# EAGLE design motherboard (EAGLE 9.5.2)
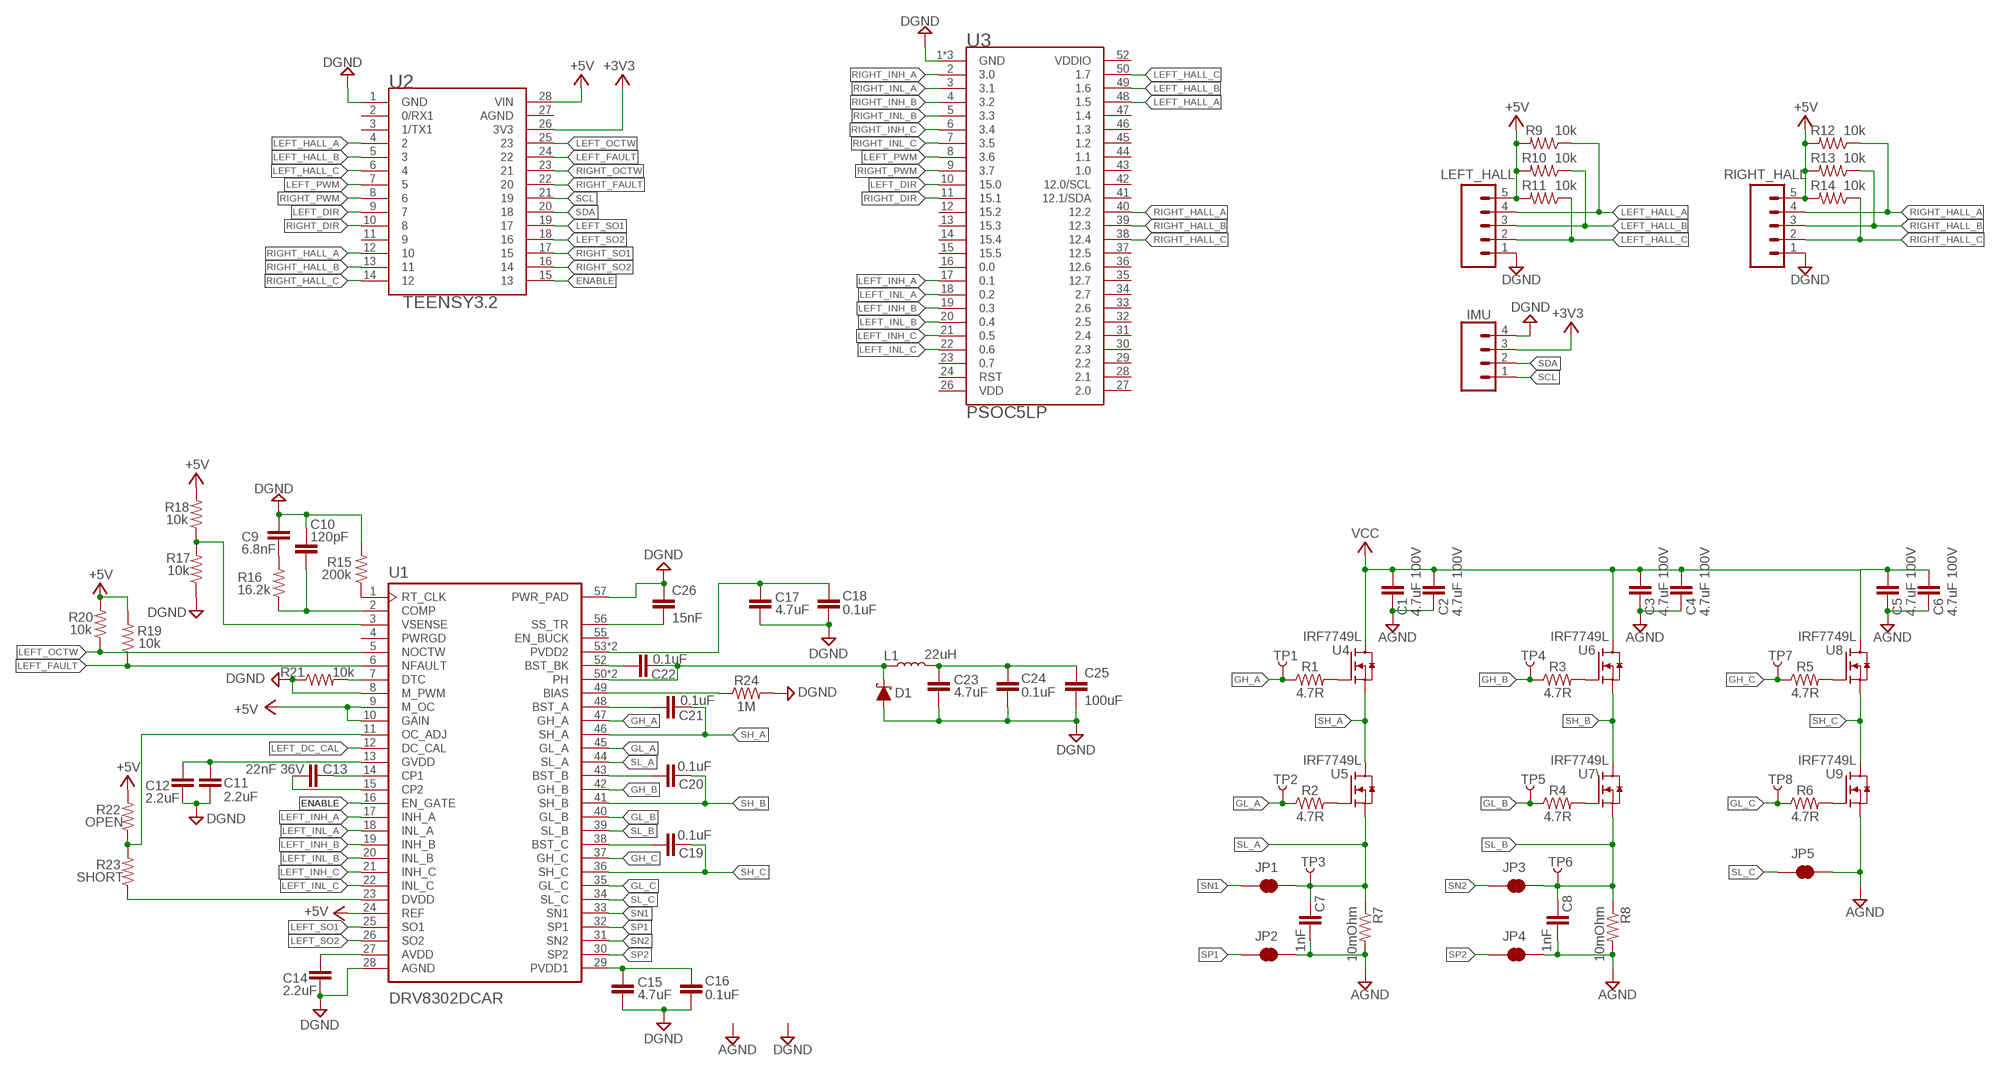
[diagram p0: schematic, sheet 1]

## Parts
C1  4.7uF 100V  10UF-1210-50V-20%  [1210]
C2  4.7uF 100V  10UF-1210-50V-20%  [1210]
C3  4.7uF 100V  10UF-1210-50V-20%  [1210]
C4  4.7uF 100V  10UF-1210-50V-20%  [1210]
C5  4.7uF 100V  10UF-1210-50V-20%  [1210]
C6  4.7uF 100V  10UF-1210-50V-20%  [1210]
C7  1nF  1.0NF/1000PF-0603-50V-10%  [0603]
C8  1nF  1.0NF/1000PF-0603-50V-10%  [0603]
C9  6.8nF  100PF-0603-50V-5%  [0603]
C10  120pF  100PF-0603-50V-5%  [0603]
C11  2.2uF  2.2UF-0805-25V-(+80/-20%)  [0805]
C12  2.2uF  2.2UF-0805-25V-(+80/-20%)  [0805]
C13  22nF 36V  22NF/22,000PF-0603-50V-10%  [0603]
C14  2.2uF  2.2UF-0805-25V-(+80/-20%)  [0805]
C15  4.7uF  4.7UF-0603-35V-(20%)  [0603]
C16  0.1uF  0.1UF-0603-25V-(+80/-20%)  [0603]
C17  4.7uF  4.7UF-0603-35V-(20%)  [0603]
C18  0.1uF  0.1UF-0603-25V-(+80/-20%)  [0603]
C19  0.1uF  0.1UF-0603-25V-(+80/-20%)  [0603]
C20  0.1uF  0.1UF-0603-25V-(+80/-20%)  [0603]
C21  0.1uF  0.1UF-0603-25V-(+80/-20%)  [0603]
C22  0.1uF  0.1UF-0603-25V-(+80/-20%)  [0603]
C23  4.7uF  4.7UF-0603-35V-(20%)  [0603]
C24  0.1uF  0.1UF-0603-25V-(+80/-20%)  [0603]
C25  100uF  100UF6.3V20%(1210)  [1210]
C26  15nF  10NF-0603-50V-10%  [0603]
D1  NRVBA2H100T3G  DIODE-SCHOTTKY-SS14  [SMA-DIODE]
IMU  SSM-104-L-SV  [SAMTEC-SSM-104-X-SV]
JP1  JUMPER-SMT_2_NC_TRACE_NO-SILK  [SMT-JUMPER_2_NC_TRACE_NO-SILK]
JP2  JUMPER-SMT_2_NC_TRACE_NO-SILK  [SMT-JUMPER_2_NC_TRACE_NO-SILK]
JP3  JUMPER-SMT_2_NC_TRACE_NO-SILK  [SMT-JUMPER_2_NC_TRACE_NO-SILK]
JP4  JUMPER-SMT_2_NC_TRACE_NO-SILK  [SMT-JUMPER_2_NC_TRACE_NO-SILK]
JP5  JUMPER-SMT_2_NC_TRACE_NO-SILK  [SMT-JUMPER_2_NC_TRACE_NO-SILK]
L1  22uH  LQH43MN330J03L  [LQH43]
LEFT_HALL  CONN_05  [1X05]
R1  4.7R  2.0KOHM-0603-1/10W-5%  [0603]
R2  4.7R  2.0KOHM-0603-1/10W-5%  [0603]
R3  4.7R  2.0KOHM-0603-1/10W-5%  [0603]
R4  4.7R  2.0KOHM-0603-1/10W-5%  [0603]
R5  4.7R  2.0KOHM-0603-1/10W-5%  [0603]
R6  4.7R  2.0KOHM-0603-1/10W-5%  [0603]
R7  10mOhm  R-US_R2512  [R2512]
R8  10mOhm  R-US_R2512  [R2512]
R9  10k  10KOHM-0603-1/10W-1%  [0603]
R10  10k  10KOHM-0603-1/10W-1%  [0603]
R11  10k  10KOHM-0603-1/10W-1%  [0603]
R12  10k  10KOHM-0603-1/10W-1%  [0603]
R13  10k  10KOHM-0603-1/10W-1%  [0603]
R14  10k  10KOHM-0603-1/10W-1%  [0603]
R15  200k  200KOHM-0603-1/10W-1%  [0603]
R16  16.2k  16.2KOHM-0603-1/10W-1%  [0603]
R17  10k  10KOHM-0603-1/10W-1%  [0603]
R18  10k  10KOHM-0603-1/10W-1%  [0603]
R19  10k  10KOHM-0603-1/10W-1%  [0603]
R20  10k  10KOHM-0603-1/10W-1%  [0603]
R21  10k  10KOHM-0603-1/10W-1%  [0603]
R22  OPEN  10KOHM-0603-1/10W-1%  [0603]
R23  SHORT  10KOHM-0603-1/10W-1%  [0603]
R24  1M  1MOHM-0603-1/4W-5%  [0603]
RIGHT_HALL  CONN_05  [1X05]
TP1  TEST-POINT3  [PAD.03X.03]
TP2  TEST-POINT3  [PAD.03X.03]
TP3  TEST-POINT3  [PAD.03X.03]
TP4  TEST-POINT3  [PAD.03X.03]
TP5  TEST-POINT3  [PAD.03X.03]
TP6  TEST-POINT3  [PAD.03X.03]
TP7  TEST-POINT3  [PAD.03X.03]
TP8  TEST-POINT3  [PAD.03X.03]
U1  DRV8302DCAR  [SOP50P810X120-57N]
U2  TEENSY3.2  [TEENSY3.2]
U3  PSOC5LP  [PSOC5LP]
U4  IRF7749L  [TRANS_AUIRF8739L2TR]
U5  IRF7749L  [TRANS_AUIRF8739L2TR]
U6  IRF7749L  [TRANS_AUIRF8739L2TR]
U7\  IRF7749L  [TRANS_AUIRF8739L2TR]
U8  IRF7749L  [TRANS_AUIRF8739L2TR]
U9  IRF7749L  [TRANS_AUIRF8739L2TR]

## Nets
+3V3: IMU.3 U2.26(3V3)
+5V: LEFT_HALL.5 R9.2 R10.2 R11.2 R12.2 R13.2 R14.2 R18.2 R19.2 R20.2 R22.2 RIGHT_HALL.5 U1.9(M_OC) U1.10(GAIN) U1.24(REF) U2.28(VIN)
AGND: C1.2 C2.2 C3.2 C4.2 C5.2 C6.2 C7.2 C8.2 JP2.2 JP4.2 JP5.2 R7.2 R8.2 U9.4(S) U9.5(S) U9.6(S) U9.7(S) U9.8(S) U9.9(S) U9.10(S) U9.11(S)
DGND: C9.1 C10.1 C11.2 C12.2 C14.2 C15.2 C16.2 C17.2 C18.2 C23.2 C24.2 C25.2 C26.1 D1.A IMU.4 LEFT_HALL.1 R15.2 R17.1 R21.1 R24.2 RIGHT_HALL.1 U1.8(M_PWM) U1.28(AGND) U1.57(PWR_PAD) U2.1(GND) U3.1(GND) U3.25(GND) U3.51(GND)
ENABLE: U1.16(EN_GATE) U2.15
GH_A: R1.1 TP1.P$1 U1.47(GH_A)
GH_B: R3.1 TP4.P$1 U1.42(GH_B)
GH_C: R5.1 TP7.P$1 U1.37(GH_C)
GL_A: R2.1 TP2.P$1 U1.45(GL_A)
GL_B: R4.1 TP5.P$1 U1.40(GL_B)
GL_C: R6.1 TP8.P$1 U1.35(GL_C)
LEFT_DC_CAL: U1.12(DC_CAL)
LEFT_DIR: U2.9 U3.10(15.0)
LEFT_FAULT: R19.1 U1.6(NFAULT) U2.24
LEFT_HALL_A: LEFT_HALL.4 R9.1 U2.4 U3.48(1.5)
LEFT_HALL_B: LEFT_HALL.3 R10.1 U2.5 U3.49(1.6)
LEFT_HALL_C: LEFT_HALL.2 R11.1 U2.6 U3.50(1.7)
LEFT_INH_A: U1.17(INH_A) U3.17(0.1)
LEFT_INH_B: U1.19(INH_B) U3.19(0.3)
LEFT_INH_C: U1.21(INH_C) U3.21(0.5)
LEFT_INL_A: U1.18(INL_A) U3.18(0.2)
LEFT_INL_B: U1.20(INL_B) U3.20(0.4)
LEFT_INL_C: U1.22(INL_C) U3.22(0.6)
LEFT_OCTW: R20.1 U1.5(NOCTW) U2.25
LEFT_PWM: U2.7 U3.8(3.6)
LEFT_SO1: U1.25(SO1) U2.19
LEFT_SO2: U1.26(SO2) U2.18
N$1: R15.1 U1.1(RT_CLK)
N$2: C9.2 R16.2
N$3: C10.2 R16.1 U1.2(COMP)
N$4: R1.2 U4.12(G)
N$5: R2.2 U5.12(G)
N$6: R3.2 U6.12(G)
N$7: R4.2 U7\.12(G)
N$8: R5.2 U8.12(G)
N$9: R6.2 U9.12(G)
N$10: R17.2 R18.1 U1.3(VSENSE)
N$11: R22.1 R23.2 U1.11(OC_ADJ)
N$12: C11.1 C12.1 U1.13(GVDD)
N$13: R21.2 U1.7(DTC)
N$14: R23.1 U1.23(DVDD)
N$15: C13.1 U1.14(CP1)
N$16: C13.2 U1.15(CP2)
N$17: C14.1 U1.27(AVDD)
N$18: C15.1 C16.1 U1.29(PVDD1)
N$19: C17.1 C18.1 U1.53(PVDD2) U1.54(PVDD2)
N$20: C19.2 U1.38(BST_C)
N$21: C20.2 U1.43(BST_B)
N$22: C21.2 U1.48(BST_A)
N$23: R24.1 U1.49(BIAS)
N$24: C22.2 U1.52(BST_BK)
N$25: C22.1 D1.C L1.1 U1.50(PH) U1.51(PH)
N$26: C23.1 C24.1 C25.1 L1.2
N$27: C26.2 U1.56(SS_TR)
RIGHT_DIR: U2.10 U3.11(15.1)
RIGHT_FAULT: U2.22
RIGHT_HALL_A: R12.1 RIGHT_HALL.4 U2.12 U3.40(12.2)
RIGHT_HALL_B: R13.1 RIGHT_HALL.3 U2.13 U3.39(12.3)
RIGHT_HALL_C: R14.1 RIGHT_HALL.2 U2.14 U3.38(12.4)
RIGHT_INH_A: U3.2(3.0)
RIGHT_INH_B: U3.4(3.2)
RIGHT_INH_C: U3.6(3.4)
RIGHT_INL_A: U3.3(3.1)
RIGHT_INL_B: U3.5(3.3)
RIGHT_INL_C: U3.7(3.5)
RIGHT_OCTW: U2.23
RIGHT_PWM: U2.8 U3.9(3.7)
RIGHT_SO1: U2.17
RIGHT_SO2: U2.16
SCL: IMU.1 U2.21
SDA: IMU.2 U2.20
SH_A: C21.1 U1.46(SH_A) U4.4(S) U4.5(S) U4.6(S) U4.7(S) U4.8(S) U4.9(S) U4.10(S) U4.11(S) U5.1(D) U5.2(D) U5.3(D) U5.13(D) U5.14(D) U5.15(D)
SH_B: C20.1 U1.41(SH_B) U6.4(S) U6.5(S) U6.6(S) U6.7(S) U6.8(S) U6.9(S) U6.10(S) U6.11(S) U7\.1(D) U7\.2(D) U7\.3(D) U7\.13(D) U7\.14(D) U7\.15(D)
SH_C: C19.1 U1.36(SH_C) U8.4(S) U8.5(S) U8.6(S) U8.7(S) U8.8(S) U8.9(S) U8.10(S) U8.11(S) U9.1(D) U9.2(D) U9.3(D) U9.13(D) U9.14(D) U9.15(D)
SL_A: C7.1 JP1.2 R7.1 TP3.P$1 U1.44(SL_A) U5.4(S) U5.5(S) U5.6(S) U5.7(S) U5.8(S) U5.9(S) U5.10(S) U5.11(S)
SL_B: C8.1 JP3.2 R8.1 TP6.P$1 U1.39(SL_B) U7\.4(S) U7\.5(S) U7\.6(S) U7\.7(S) U7\.8(S) U7\.9(S) U7\.10(S) U7\.11(S)
SL_C: JP5.1 U1.34(SL_C)
SN1: JP1.1 U1.33(SN1)
SN2: JP3.1 U1.31(SN2)
SP1: JP2.1 U1.32(SP1)
SP2: JP4.1 U1.30(SP2)
VCC: C1.1 C2.1 C3.1 C4.1 C5.1 C6.1 U4.1(D) U4.2(D) U4.3(D) U4.13(D) U4.14(D) U4.15(D) U6.1(D) U6.2(D) U6.3(D) U6.13(D) U6.14(D) U6.15(D) U8.1(D) U8.2(D) U8.3(D) U8.13(D) U8.14(D) U8.15(D)
Unconnected: U1.4(PWRGD) U1.55(EN_BUCK) U2.2(0/RX1) U2.3(1/TX1) U2.11 U2.27(AGND) U3.12(15.2) U3.13(15.3) U3.14(15.4) U3.15(15.5) U3.16(0.0) U3.23(0.7) U3.24(RST) U3.26(VDD) U3.27(2.0) U3.28(2.1) U3.29(2.2) U3.30(2.3) U3.31(2.4) U3.32(2.5) U3.33(2.6) U3.34(2.7) U3.35(12.7) U3.36(12.6) U3.37(12.5) U3.41(12.1/SDA) U3.42(12.0/SCL) U3.43(1.0) U3.44(1.1) U3.45(1.2) U3.46(1.3) U3.47(1.4) U3.52(VDDIO)

## Library data of the parts
C1-C6 = SparkFun-Capacitors:10UF: 10.0µF ceramic capacitors A capacitor is a passive two-terminal electrical component used to store electrical energy temporarily in an electric field.; PROD_ID: CAP-09824; VALUE: 10uF
C7 C8 = SparkFun-Capacitors:1.0NF/1000PF: 1nF/1,000pF ceramic capacitors A capacitor is a passive two-terminal electrical component used to store electrical energy temporarily in an electric field.; PROD_ID: CAP-07886
C9 C10 = SparkFun-Capacitors:100PF: 100pF/0.1nF ceramic capacitors A capacitor is a passive two-terminal electrical component used to store electrical energy temporarily in an electric field.; PROD_ID: CAP-07883; VALUE: 100pF
C11 C12 C14 = SparkFun-Capacitors:2.2UF: 2.2µF ceramic capacitors A capacitor is a passive two-terminal electrical component used to store electrical energy temporarily in an electric field.; PROD_ID: CAP-11624
C13 = SparkFun-Capacitors:22NF/22,000PF: 0.022uF/22nF/22,000pF ceramic capacitors A capacitor is a passive two-terminal electrical component used to store electrical energy temporarily in an electric field.; PROD_ID: CAP-07885; VALUE: 22nF
C15 C17 C23 = SparkFun-Capacitors:4.7UF: 4.7µF ceramic capacitors A capacitor is a passive two-terminal electrical component used to store electrical energy temporarily in an electric field.; PROD_ID: CAP-14106
C16 C18-C22 C24 = SparkFun-Capacitors:0.1UF: 0.1µF ceramic capacitors A capacitor is a passive two-terminal electrical component used to store electrical energy temporarily in an electric field.; PROD_ID: CAP-00810
C25 = SparkFun-Retired:100UF6.3V20%(1210): CAP-09827; PROD_ID: CAP-09827
C26 = SparkFun-Capacitors:10NF: 0.01uF/10nF/10,000pF ceramic capacitors A capacitor is a passive two-terminal electrical component used to store electrical energy temporarily in an electric field. CAP-09321; PROD_ID: CAP-00867; VALUE: 10nF
D1 = SparkFun-DiscreteSemi:DIODE-SCHOTTKY: Schottky diode A Schottky diode is a semiconductor diode which has a low forward voltage drop and a very fast switching action.; PROD_ID: DIO-08053; VALUE: 1A/40V/500mV
IMU = kanzi:SSM-104-L-SV
JP1-JP5 = SparkFun-Jumpers:JUMPER-SMT_2_NC_TRACE: Normally closed trace jumper This jumper has a trace between two pads so it's normally closed (NC). Use a razor knife to open the connection. For best results follow the IPC guidelines for cutting traces: Cutout at least 0.063 mm (0.005 in). Remove all loose material to clean up the cut area. Seal the cut with an approved epoxy. Reapply solder to reclose the connection.
L1 = IndividualNode:LQH43MN330J03L: 33uH 5% 1.2Ohm 270mA Inductor
LEFT_HALL RIGHT_HALL = SparkFun-Connectors:CONN_05: Multi connection point. Often used as Generic Header-pin footprint for 0.1 inch spaced/style header connections On any of the 0.1 inch spaced packages, you can populate with these: Break Away Headers - Straight <https://www.sparkfun.com/products/116> (PRT-00116) Break Away Male Headers - Right Angle <https://www.sparkfun.com/products/553> (PRT-00553) Female Headers <https://www.sparkfun.com/products/115> (PRT-00115) Break Away Headers - Machine Pin <https://www.sparkfun.com/products/117> (PRT-00117) Break Away Female Headers - Swiss Machine Pin <https://www.sparkfun.com/products/743> (PRT-00743) For SCREWTERMINALS and SPRING TERMINALS visit here: Screw Terimnals on SparkFun.com <https://www.sparkfun.com/search/results?term=Screw+Terminals> (5mm/3.5mm/2.54mm spacing) This device is also useful as a general connection point to wire up your design to another part of your project. Our various solder wires solder well into these plated through hole pads. Hook-Up Wire - Assortment (Stranded, 22 AWG) <https://www.sparkfun.com/products/11375> (PRT-11375) Hook-Up Wire - Assortment (Solid Core, 22 AWG) <https://www.sparkfun.com/products/11367> (PRT-11367) View the entire wire category on our website here <https://www.sparkfun.com/categories/141> Special notes: Molex polarized connector foot print use with SKU : PRT-08231 with associated crimp pins and housings. 1MM SMD Version SKU: PRT-10208
R1-R6 = SparkFun-Resistors:2.0KOHM: 2kΩ resistor A resistor is a passive two-terminal electrical component that implements electrical resistance as a circuit element. Resistors act to reduce current flow, and, at the same time, act to lower voltage levels within circuits. - Wikipedia; PROD_ID: RES-08296; VALUE: 2.0k
R7 R8 = rcl:R-US_: RESISTOR, American symbol; SPICEPREFIX: R
R9-R14 R17-R21 = SparkFun-Resistors:10KOHM: 10kΩ resistor A resistor is a passive two-terminal electrical component that implements electrical resistance as a circuit element. Resistors act to reduce current flow, and, at the same time, act to lower voltage levels within circuits. - Wikipedia; PROD_ID: RES-00824
R15 = SparkFun-Resistors:200KOHM: 200kΩ resistor A resistor is a passive two-terminal electrical component that implements electrical resistance as a circuit element. Resistors act to reduce current flow, and, at the same time, act to lower voltage levels within circuits. - Wikipedia; PROD_ID: RES-09385
R16 = SparkFun-Resistors:16.2KOHM: 16.2kΩ resistor A resistor is a passive two-terminal electrical component that implements electrical resistance as a circuit element. Resistors act to reduce current flow, and, at the same time, act to lower voltage levels within circuits. - Wikipedia; PROD_ID: RES-12187
R22 R23 = SparkFun-Resistors:10KOHM: 10kΩ resistor A resistor is a passive two-terminal electrical component that implements electrical resistance as a circuit element. Resistors act to reduce current flow, and, at the same time, act to lower voltage levels within circuits. - Wikipedia; PROD_ID: RES-00824; VALUE: 10k
R24 = SparkFun-Resistors:1MOHM: 1MΩ resistor A resistor is a passive two-terminal electrical component that implements electrical resistance as a circuit element. Resistors act to reduce current flow, and, at the same time, act to lower voltage levels within circuits. - Wikipedia; PROD_ID: RES-07868
TP1-TP8 = SparkFun-Connectors:TEST-POINT: SparkFun Test Points Bare copper test points for troubleshooting or In-Circuit-Testing. These are used by our Production team for verifying production board runs using pogo-pins on test beds. SparkFun Products: SparkFun LSM9DS1 Breakout <https://www.sparkfun.com/products/13284> SparkFun PSOC <https://www.sparkfun.com/products/13714> SparkFun Load Cell Amplifier <https://www.sparkfun.com/products/13879>
U1 = kanzi:DRV8302DCAR: 3-Phase Brushless Motor Pre-Driver with Dual Current Sense Amps and Buck Converter (PWM Ctrl) 56-HTSSOP -40 to 125; AVAILABILITY: Unavailable; DESCRIPTION: 3-Phase Brushless Motor Pre-Driver with Dual Current Sense Amps and Buck Converter _PWM Ctrl_ 56-HTSSOP -40 to 125; MF: Texas Instruments; MP: DRV8302DCAR; PACKAGE: HTSSOP-56 Texas Instruments; PRICE: None
U2 = kanzi:TEENSY3.2
U3 = kanzi:PSOC5LP
U4-U6 U7\ U8 U9 = kanzi:IRF7749L

## Board
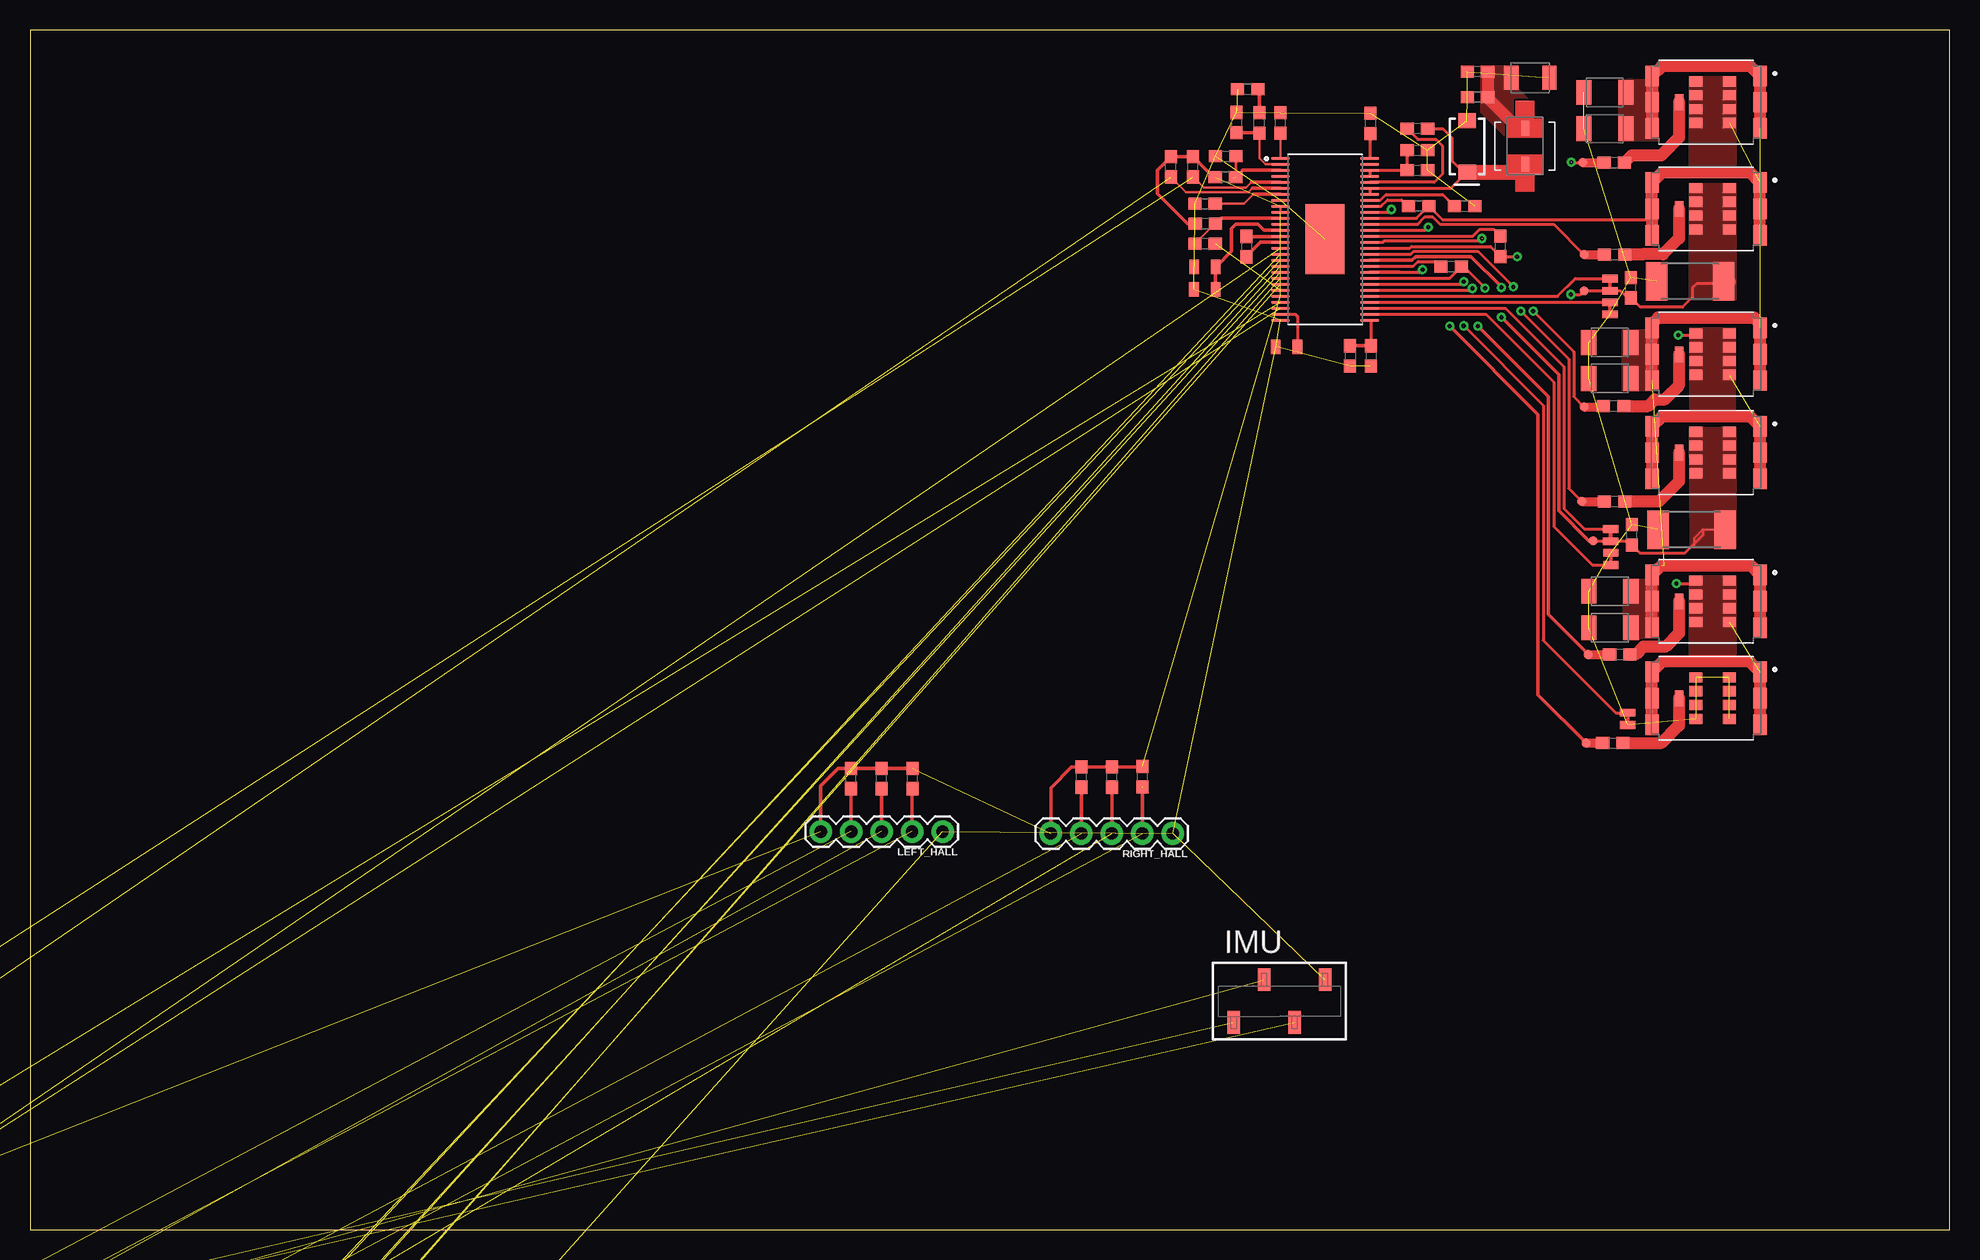
[diagram p1: board, top side]
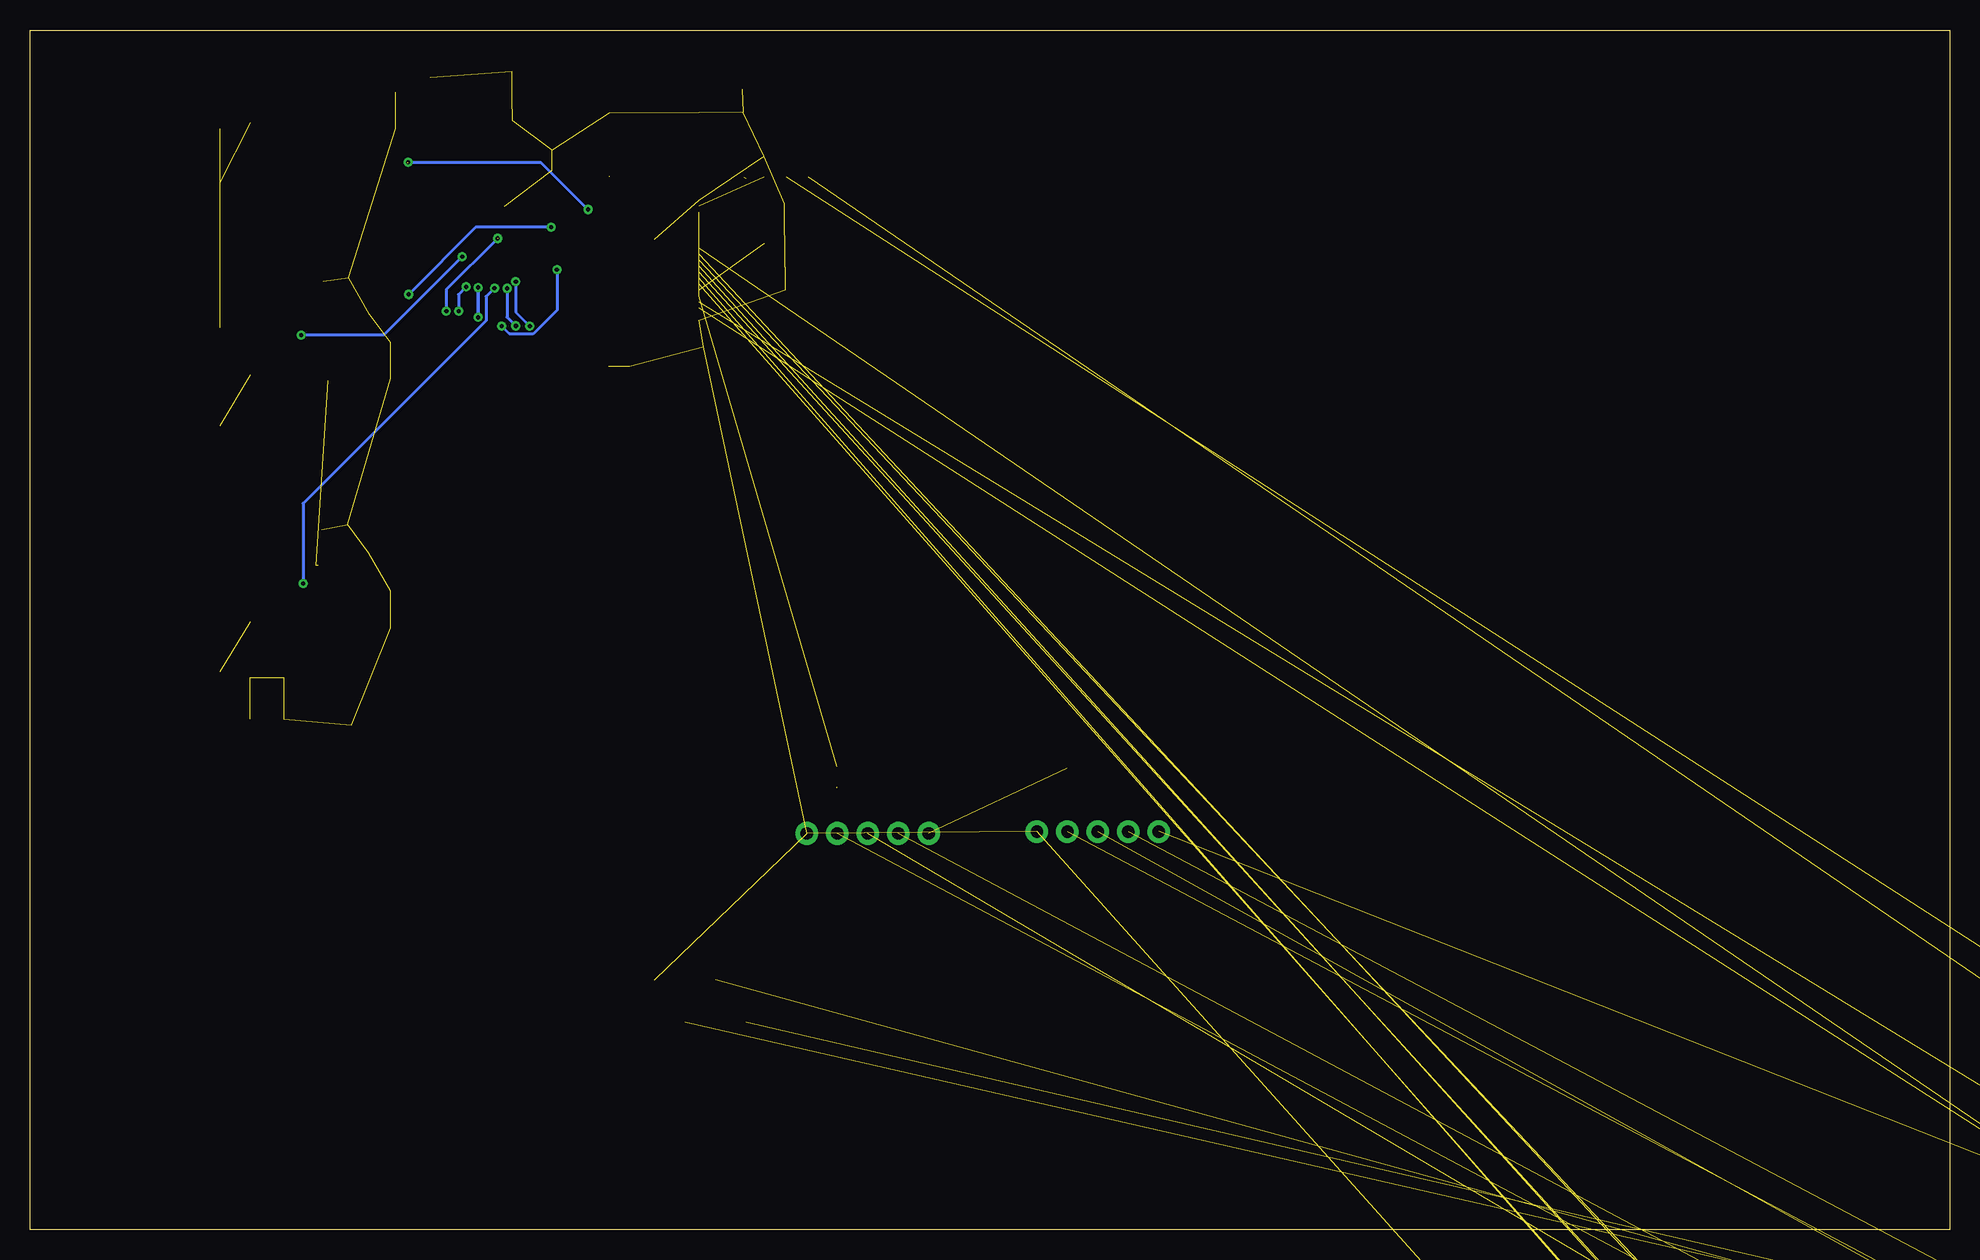
[diagram p2: board, bottom side, seen from below]

Size 160 x 100 mm. Coordinates in mm from the lower left corner, seen from the top.
Outline: 0,0 160,0 160,100 0,100 0,0
Copper layers (1*16): Top 0.035mm / dielectric 1.5mm / Bottom 0.035mm
Design rules "default": minimum track width 6mil, minimum drill 0.35mm, track to track 6mil, track to pad 6mil, pad to pad 6mil, via to via 6mil, smd to smd 6mil, copper to edge 40mil, drill to drill 6mil, minimum pad ring 10mil, minimum via ring 8mil, stop-mask expansion 4mil, vias tented up to drill 0mil, thermal gap 10mil

### Footprints (pad centres in the part's own frame; a part is rotated, then mirrored left to right if it is on the bottom)
1210 = smd 1.27 x 2.06: 1 -1.755,0; 2 1.755,0
0603 = smd 1.1 x 1: 1 -0.85,0; 2 0.85,0
0805 = smd 0.8 x 1.2: 1 -0.9,0; 2 0.9,0
1210' = smd 1.2 x 2: 1 -1.6,0; 2 1.6,0
SMA-DIODE = smd 1.27 x 1.47: A -2.15,0; C 2.15,0
SAMTEC-SSM-104-X-SV = smd 1.02 x 1.905: 1 -3.81,-1.778; 2 -1.27,1.778; 3 1.27,-1.778; 4 3.81,1.778
SMT-JUMPER_2_NC_TRACE_NO-SILK = smd 0.635 x 1.27: 1 -0.508,0; 2 0.508,0
LQH43 = smd 1.27 x 0.635: 1 -1.5,0; 2 1.5,0
1X05 = drill 1.016 pad 1.88: 1 0,0; 2 2.54,0; 3 5.08,0; 4 7.62,0; 5 10.16,0
R2512 = smd 1.8 x 3.2: 1 -2.8,0; 2 2.8,0
PAD.03X.03 = smd 0.762 x 0.762: P$1 0,0
SOP50P810X120-57N = smd 1.57 x 0.28: 1 -3.72,6.75; 2 -3.72,6.25; 3 -3.72,5.75; 4 -3.72,5.25; 5 -3.72,4.75; 6 -3.72,4.25; 7 -3.72,3.75; 8 -3.72,3.25; 9 -3.72,2.75; 10 -3.72,2.25; 11 -3.72,1.75; 12 -3.72,1.25; 13 -3.72,0.75; 14 -3.72,0.25; 15 -3.72,-0.25; 16 -3.72,-0.75; 17 -3.72,-1.25; 18 -3.72,-1.75; 19 -3.72,-2.25; 20 -3.72,-2.75; 21 -3.72,-3.25; 22 -3.72,-3.75; 23 -3.72,-4.25; 24 -3.72,-4.75; 25 -3.72,-5.25; 26 -3.72,-5.75; 27 -3.72,-6.25; 28 -3.72,-6.75; 29 3.72,-6.75; 30 3.72,-6.25; 31 3.72,-5.75; 32 3.72,-5.25; 33 3.72,-4.75; 34 3.72,-4.25; 35 3.72,-3.75; 36 3.72,-3.25; 37 3.72,-2.75; 38 3.72,-2.25; 39 3.72,-1.75; 40 3.72,-1.25; 41 3.72,-0.75; 42 3.72,-0.25; 43 3.72,0.25; 44 3.72,0.75; 45 3.72,1.25; 46 3.72,1.75; 47 3.72,2.25; 48 3.72,2.75; 49 3.72,3.25; 50 3.72,3.75; 51 3.72,4.25; 52 3.72,4.75; 53 3.72,5.25; 54 3.72,5.75; 55 3.72,6.25; 56 3.72,6.75 | smd 3.235 x 5.82: 57 0,0
TEENSY3.2 = smd 1.02 x 1.905: 1 -16.51,-13.208; 2 -13.97,-9.652; 3 -11.43,-13.208; 4 -8.89,-9.652; 5 -6.35,-13.208; 6 -3.81,-9.652; 7 -1.27,-13.208; 8 1.27,-9.652; 9 3.81,-13.208; 10 6.35,-9.652; 11 8.89,-13.208; 12 11.43,-9.652; 13 13.97,-13.208; 14 16.51,-9.652; 15 16.51,10.668; 16 13.97,7.112; 17 11.43,10.668; 18 8.89,7.112; 19 6.35,10.668; 20 3.81,7.112; 21 1.27,10.668; 22 -1.27,7.112; 23 -3.81,10.668; 24 -6.35,7.112; 25 -8.89,10.668; 26 -11.43,7.112; 27 -13.97,10.668; 28 -16.51,7.112
PSOC5LP = smd 1.02 x 1.905: 1 -31.75,-13.208; 2 -29.21,-9.652; 3 -26.67,-13.208; 4 -24.13,-9.652; 5 -21.59,-13.208; 6 -19.05,-9.652; 7 -16.51,-13.208; 8 -13.97,-9.652; 9 -11.43,-13.208; 10 -8.89,-9.652; 11 -6.35,-13.208; 12 -3.81,-9.652; 13 -1.27,-13.208; 14 1.27,-9.652; 15 3.81,-13.208; 16 6.35,-9.652; 17 8.89,-13.208; 18 11.43,-9.652; 19 13.97,-13.208; 20 16.51,-9.652; 21 19.05,-13.208; 22 21.59,-9.652; 23 24.13,-13.208; 24 26.67,-9.652; 25 29.21,-13.208; 26 31.75,-9.652; 27 31.75,10.668; 28 29.21,7.112; 29 26.67,10.668; 30 24.13,7.112; 31 21.59,10.668; 32 19.05,7.112; 33 16.51,10.668; 34 13.97,7.112; 35 11.43,10.668; 36 8.89,7.112; 37 6.35,10.668; 38 3.81,7.112; 39 1.27,10.668; 40 -1.27,7.112; 41 -3.81,10.668; 42 -6.35,7.112; 43 -8.89,10.668; 44 -11.43,7.112; 45 -13.97,10.668; 46 -16.51,7.112; 47 -19.05,10.668; 48 -21.59,7.112; 49 -24.13,10.668; 50 -26.67,7.112; 51 -29.21,10.668; 52 -31.75,7.112
TRANS_AUIRF8739L2TR = smd 1.1 x 1.7: 1 4.5,2.2; 2 4.5,0; 3 4.5,-2.2; 13 -4.5,2.2; 14 -4.5,0; 15 -4.5,-2.2 | smd 1.1 x 0.85: 4 1.95,1.725; 5 1.95,0.575; 6 1.95,-0.575; 7 1.95,-1.725; 8 -0.85,1.725; 9 -0.85,0.575; 10 -0.85,-0.575; 11 -0.85,-1.725 | smd 0.7 x 1.3: 12 -2.25,0

### Placement (x,y rotation side)
C1  131.7,50.16 180 top
C2  131.7,53.21 180 top
C3  131.67,73.94 180 top
C4  131.67,70.94 180 top
C5  131.27,94.79 180 top
C6  131.27,91.77 180 top
C7  133.45,78.51 90 top
C8  133.53,57.91 90 top
C9  101.5,95.07 0 top
C10  100.56,92.28 270 top
C11  97.94,80.24 180 top
C12  97.92,78.36 180 top
C13  101.4,81.94 270 top
C14  104.75,73.58 180 top
C15  110.03,72.82 270 top
C16  111.76,72.82 270 top
C17  115.65,88.32 0 top
C18  115.65,89.97 0 top
C19  118.47,80.26 180 top
C20  122.58,81.97 90 top
C21  115.75,85.32 180 top
C22  115.65,91.77 180 top
C23  120.65,94.41 180 top
C24  120.65,96.52 180 top
C25  100uF  [1210']  125.04,96.04 0 top
C26  111.71,92.2 270 top
D1  119.79,90.3 270 top
IMU  104.14,19.05 0 top
JP1  131.7,78.77 270 top
JP2  131.7,76.78 270 top
JP3  131.75,57.89 270 top
JP4  131.78,55.91 90 top
JP5  133.17,42.57 270 top
L1  124.61,90.32 90 top
LEFT_HALL  76.07,33.17 180 top
R1  132.05,88.95 0 top
R2  132.08,81.28 0 top
R3  132,68.66 0 top
R4  132.08,60.71 0 top
R5  132.51,47.96 0 top
R6  131.93,40.56 0 top
R7  138.38,79.04 180 top
R8  138.51,58.34 180 top
R9  68.45,37.59 90 top
R10  70.99,37.59 90 top
R11  73.56,37.59 90 top
R12  87.66,37.72 90 top
R13  90.2,37.72 90 top
R14  92.74,37.74 90 top
R15  104.24,92.25 90 top
R16  102.46,92.25 90 top
R17  99.67,89.48 0 top
R18  99.64,87.73 180 top
R19  95.1,88.6 90 top
R20  96.95,88.6 90 top
R21  97.94,85.52 0 top
R22  97.97,83.85 180 top
R23  97.94,82.17 180 top
R24  119.58,85.32 0 top
RIGHT_HALL  95.25,33.02 180 top
TP1  129.41,88.95 0 top
TP2  129.54,81.28 0 top
TP3  129.54,78.26 0 top
TP4  129.54,68.58 0 top
TP5  129.34,60.71 0 top
TP6  130.3,57.4 0 top
TP7  129.87,47.93 0 top
TP8  129.69,40.54 0 top
U1  107.95,82.55 0 top
U2  -60.96,-30.48 0 top  (outside the outline)
U3  -45.72,-57.15 0 top  (outside the outline)
U4  139.7,93.98 0 top
U5  139.7,85.09 0 top
U6  139.7,72.97 0 top
U7\  139.7,64.77 0 top
U8  139.7,52.37 0 top
U9  139.7,44.3 0 top

### Tracks (layer width: path | path; a pad name or v marks a point on that pad's centre or on a via)
+3V3  (1 unrouted)
+5V  (5 unrouted)
  Top 0.203: U1.9 U1.10
  Top 0.305: R11.2 R10.2 R9.2 67.37,38.44 65.91,36.98 LEFT_HALL.5 | RIGHT_HALL.5 85.09,36.83 86.83,38.57 R12.2 R13.2 92.71,38.57 R14.2 | R18.2 98.67,87.73 R20.2 R19.2 93.98,88.33 93.98,86.36 96.5,83.84 R22.2
AGND  (20 unrouted)
DGND  (27 unrouted)
  Top 0.305: 97.02,80.21 C11.2
ENABLE  (1 unrouted)
GH_A  (via drill 0.35)  (1 unrouted)
  Top 0.254: U1.47 113.25,84.8 v113.49,85.04 | v128.47,88.98 128.5,88.95 TP1.P$1
  Top 0.762: TP1.P$1 R1.1
  Bottom 0.254: v113.49,85.04 117.4,88.95 128.52,88.95
GH_B  (via drill 0.35)  (1 unrouted)
  Top 0.254: v125.3,76.56 128.68,73.18 128.68,69.44 TP4.P$1 | U1.42 112.78,82.3 112.86,82.38 120.81,82.38 121.03,82.6 v121.03,82.63
  Top 0.762: TP4.P$1 131.08,68.58 R3.1
  Bottom 0.254: v125.3,76.56 125.3,78.33 121.02,82.61
GH_C  (via drill 0.35)
  Top 0.254: 113.03,79.8 115.84,79.8 116.15,80.11 v116.08,80.03
  Top 0.305: U1.37 113.03,79.8 114.13,79.8 | v120.67,75.31 126.57,69.42 126.57,51.28 129.9,47.95
  Top 0.762: TP7.P$1 129.9,47.95 R5.1
  Bottom 0.254: v116.08,80.03 116.08,76.64 118.07,74.65 120.02,74.65 v120.67,75.31
GL_A
  Top 0.254: TP2.P$1 127.02,83.8 117.54,83.8 116.91,84.43 116.84,84.43 116.28,84.43 115.63,83.78 111.69,83.78 U1.45
  Top 0.762: TP2.P$1 R2.1
GL_B  (via drill 0.35)
  Top 0.254: U1.40 115.09,81.3 115.34,81.55 120.68,81.55 v123.65,78.59 | v124.28,76.56 128.27,72.57 128.27,61.77 TP5.P$1
  Top 0.762: TP5.P$1 R4.1
  Bottom 0.254: v123.65,78.59 124.28,77.95 v124.28,76.56
GL_C  (via drill 0.35)
  Top 0.254: v119.51,79.02 119.29,78.8 U1.35
  Top 0.305: v118.34,75.31 125.7,67.94 125.7,44.58 129.72,40.56
  Top 0.762: TP8.P$1 129.72,40.56 R6.1
  Bottom 0.254: v119.51,79.02 119.51,76.48 v118.34,75.31
LEFT_DIR  (1 unrouted)
LEFT_FAULT  (1 unrouted)
  Top 0.203: 101.88,86.8 101.58,86.5 96.35,86.5 R19.1
  Top 0.279: 101.88,86.8 U1.6
LEFT_HALL_A  (2 unrouted)
  Top 0.305: LEFT_HALL.4 R9.1
LEFT_HALL_B  (2 unrouted)
  Top 0.305: LEFT_HALL.3 R10.1
LEFT_HALL_C  (2 unrouted)
  Top 0.305: LEFT_HALL.2 73.53,36.72 R11.1
LEFT_INH_A  (1 unrouted)
LEFT_INH_B  (1 unrouted)
LEFT_INH_C  (1 unrouted)
LEFT_INL_A  (1 unrouted)
LEFT_INL_B  (1 unrouted)
LEFT_INL_C  (1 unrouted)
LEFT_OCTW  (1 unrouted)
  Top 0.203: 101.8,87.3 101.35,86.85 97.85,86.85 R20.1
  Top 0.279: 101.8,87.3 U1.5
LEFT_PWM  (1 unrouted)
LEFT_SO1  (1 unrouted)
LEFT_SO2  (1 unrouted)
N$1
  Top 0.203: U1.1 R15.1
N$2
  Top 0.305: C9.2 102.46,94.96 R16.2
N$3
  Top 0.203: U1.2 102.97,88.8 102.46,89.31 R16.1
  Top 0.305: C10.2 102.44,91.43 R16.1
N$4
  Top 1.016: U4.12 137.45,91.04 135.94,89.53 133.49,89.53 R1.2
N$5
  Top 1.016: U5.12 137.44,85.08 137.44,82.63 136.12,81.31 134.41,81.31 134.38,81.28 R2.2
N$6
  Top 1.016: R3.2 134.9,68.66 135.44,69.19 136.25,69.19 137.47,70.41 137.47,72.96 U6.12
N$7
  Top 1.016: U7\.12 137.45,62.37 135.79,60.71 R4.2
N$8
  Top 1.016: R5.2 133.84,47.95 134.45,48.56 136.3,48.56 137.45,49.71 U8.12
N$9
  Top 1.016: U9.12 137.45,42.02 136,40.56 R6.2
N$10  (1 unrouted)
  Top 0.203: R17.2 100.52,87.82 100.33,87.63 | 101.06,88.3 R18.1
  Top 0.279: U1.3 101.06,88.3
N$11
  Top 0.203: R23.2 98.72,83.79 98.87,83.79 R22.1 99.27,84.3
  Top 0.279: U1.11 99.27,84.3
N$12
  Top 0.279: 102.86,83.3 U1.13
  Top 0.305: 102.86,83.3 102.34,83.82 100.54,83.82 100.15,83.44 100.15,81.55 C11.1 98.82,80.21 C12.1
N$13
  Top 0.203: 101.96,86.3 101.18,85.52 R21.2 98.93,85.66
  Top 0.279: U1.7 101.96,86.3
N$14  (1 unrouted)
N$15
  Top 0.279: U1.14 C13.1
  Top 0.305: U1.14
N$16
  Top 0.279: U1.15 102.57,82.3
  Top 0.305: 102.57,82.3 101.4,81.13 C13.2
N$17
  Top 0.254: U1.27 105.49,76.3 105.66,76.12 105.66,73.6 C14.1
N$18
  Top 0.254: U1.29 111.76,75.71 C16.1
  Top 0.305: C15.1 C16.1
N$19  (1 unrouted)
  Top 0.254: C18.1 C17.1 114.78,88.3 U1.54 111.69,88.28 111.69,87.78
N$20
  Top 0.254: C19.2 117.6,80.25 117.16,80.69 115.7,80.69 115.31,80.3 U1.38
N$21
  Top 0.254: U1.43 120.26,82.8 120.81,83.35 122.05,83.35 C20.2
N$22
  Top 0.254: C21.2 114.88,85.3 114.35,85.83 113.15,85.83 112.62,85.3 U1.48
N$23
  Top 0.254: U1.49 112.55,85.8 113.03,86.28 117.77,86.28 R24.1
N$24
  Top 0.254: C22.2 115.69,90.88 117.2,90.88 117.72,90.36 117.72,87.98 117.04,87.3 U1.52 | U1.52
N$25
  Top 0.254: U1.50 U1.51 118.44,86.8 D1.C 119.47,88.15 118.52,89.1 118.52,91.03 117.78,91.77 C22.1
  Top 1.27: D1.C 123.94,88.15 L1.1
N$26
  Top 1.016: L1.2 124,91.82 121.5,94.33 C23.1 C24.1
  pour Top (no thermals): 123.06,91.01 120.95,93.12 120.95,97 124.05,97 124.05,95.05 124.97,94.13 125.43,94.13 125.43,92.63 126.16,92.63 126.19,92.61 126.19,91.06 126.14,91.01
N$27
  Top 0.254: U1.56 111.71,89.34 C26.2
RIGHT_DIR  (1 unrouted)
RIGHT_HALL_A  (2 unrouted)
  Top 0.305: RIGHT_HALL.4 87.63,36.84 R12.1
RIGHT_HALL_B  (2 unrouted)
  Top 0.305: RIGHT_HALL.3 90.17,36.84 R13.1
RIGHT_HALL_C  (3 unrouted)
  Top 0.305: RIGHT_HALL.2 92.71,36.83
RIGHT_PWM  (1 unrouted)
SCL  (1 unrouted)
SDA  (1 unrouted)
SH_A  (1 unrouted)
  Top 0.254: U1.46 115.58,84.3 C21.1 117.71,84.21 134.81,84.21 135.2,83.82
  Top 0.305: 135.13,82.96 U5.15
  Top 1.016: U5.3 U5.2 U5.1 143.35,88.14 136.05,88.14 U5.13 U5.14 135.2,83.82 U5.15
  pour Top (no thermals): 138.3,96.14 142.19,96.14 142.19,87.68 138.3,87.68
SH_B  (via drill 0.35)  (1 unrouted)
  Top 0.254: U1.41 115.01,81.8 115.17,81.96 121.74,81.96 C20.1 123.94,81.12 v123.95,81.1 v123.97,81.11 | v137.39,74.57 138.72,74.57 U6.8
  Top 1.016: U7\.15 U7\.14 U7\.13 136.05,67.82 143.35,67.82 U7\.1 U7\.2 U7\.3
  Bottom 0.254: v123.97,81.11 130.5,74.57 v137.39,74.57
  pour Top (no thermals): 138.3,75.13 138.3,67.36 142.19,67.36 142.19,75.13
SH_C  (via drill 0.35)  (1 unrouted)
  Top 0.254: U1.36 118.35,79.3 C19.1 119.65,79.93 119.86,79.93 121.28,78.51 v121.28,78.49 | v137.24,53.85 138.6,53.85 U8.8
  Top 1.016: U9.15 U9.14 U9.13 136.07,47.37 143.33,47.37 U9.1 U9.2 U9.3
  Bottom 0.254: v121.28,78.49 122,77.77 122,75.78 137.24,60.54 v137.24,53.85
  pour Top (no thermals): 138.3,54.53 142.19,54.53 142.19,47.04 138.3,47.04
SL_A  (via drill 0.35)
  Top 0.203: 140.79,79.96 140.87,79.96 141.83,78.99 | 133.47,77.66 C7.1
  Top 0.254: R7.1 141,78.87 138.94,78.87 138.58,78.51 138.58,77.72 137.74,76.89 134.24,76.89 133.47,77.66 | 133.31,77.52 132.56,78.26 JP1.2 TP3.P$1 129.24,77.96 v128.45,77.96 | U1.44 116.3,83.3 v116.56,83.57
  Top 0.305: 133.13,77.34 133.31,77.52 C7.1
  Top 0.762: 141.83,78.99 141.71,79.12
  Bottom 0.254: v116.56,83.57 122.83,83.57 v128.45,77.95 v128.45,77.96
  pour Top (no thermals): 138.3,87.25 142.19,87.25 142.19,77.47 138.3,77.47
SL_B  (via drill 0.35)
  Top 0.203: 138.74,57.12 138.74,57.66 139.42,58.34 R8.1
  Top 0.254: JP3.2 132.16,57.38 | TP6.P$1 131.72,57.4 JP3.2 | 139.42,58.34 139.42,57.89 137.9,56.36 134.23,56.36 C8.1 133.21,57.38 JP3.2
  Top 0.305: U1.39 115.2,80.8 115.52,81.12 120.12,81.12 122.66,78.59 v122.66,78.54 | v122.66,76.05 127.43,71.27 127.43,59.92 129.94,57.4 TP6.P$1
  Bottom 0.305: v122.66,78.54 v122.66,76.05
  pour Top (no thermals): 138.37,66.85 142.14,66.85 142.14,56.82 138.43,56.82
SL_C  (via drill 0.35)
  Top 0.254: v119.51,75.34 126.14,68.71 126.14,49.12 132.18,43.08 JP5.1 | v120.23,78.46 120.07,78.3 U1.34
  Bottom 0.254: v120.23,78.46 120.23,76.06 v119.51,75.34
SN1
  Top 0.254: U1.33 127.33,77.8 128.8,79.27 JP1.1
SN2
  Top 0.254: U1.31 122.99,76.8 127.86,71.92 127.86,60.1 129.56,58.4 JP3.1
SP1
  Top 0.254: U1.32 JP2.1
SP2
  Top 0.254: U1.30 121.36,76.3 127,70.66 127,58.62 130.23,55.4 JP4.1
VCC  (3 unrouted)
  Top 1.016: U4.15 U4.14 U4.13 136.05,97.03 143.35,97.03 U4.1 U4.2 U4.3 | U6.15 U6.14 U6.13 135.2,75.51 135.71,76.02 143.69,76.02 144.2,75.51 U6.1 U6.2 U6.3 | U8.15 U8.14 U8.13 135.97,55.35 | 136.2,55.35 143.43,55.35 U8.1 U8.2 U8.3
  pour Top (no thermals): 132.38,95.83 132.38,90.75 135.74,90.75 135.74,95.83
  pour Top (no thermals): 132.82,54.23 135.71,54.23 135.71,49.17 132.82,49.17
  pour Top (no thermals): 132.79,74.98 135.69,74.98 135.69,69.93 132.79,69.93